# Altium schematic sheet BMS_Switches.SchDoc
size A
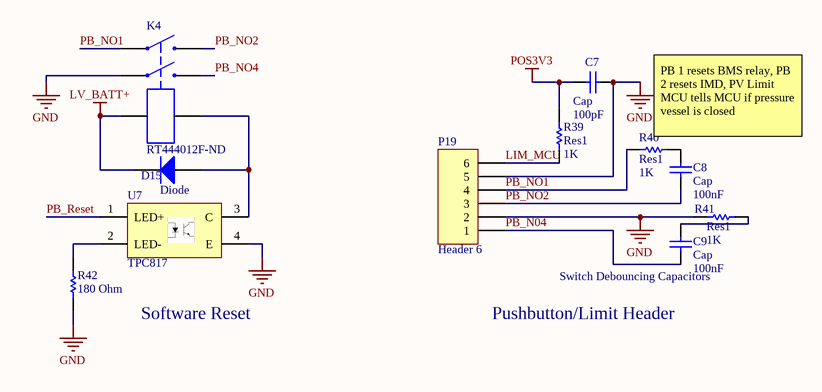
[diagram p0: BMS_Switches.SchDoc]

## Parts
C7  Cap  value 100pF  [1206]
C8  Cap  value 100nF  [1206]
C9  Cap  value 100nF  [1206]
D15  Diode  [1N4007]
K4  RT444012F-ND  [RT444012F]
P19  Header 6  [6POS TERM BLOCK]
R39  Res1  value 1K  [1206]
R40  Res1  value 1K  [1206]
R41  Res1  value 1K  [1206]
R42  value 180 Ohm  [1206]  (hidden comment: Res1)
U7  TPC817  [4-SOP]

## Nets
GND: C7.1 K4.3 P19.2 P19.5 R41.1 R42.2 U7.4(E)
LV_BATT+: D15.2(K) K4.1
POS3V3: C7.2 R39.2
LIM_MCU: P19.6 R39.1
PB_N04: C9.1 P19.1
PB_NO1: K4.5 P19.4 R40.1
PB_NO2: C8.1 K4.6 P19.3
PB_NO4: K4.4
PB_Reset: U7.1(LED+)
NetC8_2: C8.2 R40.2
NetC9_2: C9.2 R41.2
NetD15_1: D15.1(A) K4.2 U7.3(C)
NetR42_1: R42.1 U7.2(LED-)

## Notes on the sheet
- (near R40) PB 1 resets BMS relay, PB 2 resets IMD, PV Limit MCU tells MCU if pressure vessel is closed
- (near C9) Switch Debouncing Capacitors
- Software Reset
- Pushbutton/Limit Header

## Library data of the parts
C7-C9 = Cap: Capacitor; Published: 8-Jun-2000; LatestRevisionDate: 17-Jul-2002; LatestRevisionNote: Re-released for DXP Platform.; PackageReference: RAD-0.3; Publisher: Altium Limited; PackageDescription: Radial Cap, Thru-Hole; 2 Leads; 0.3 in Pin Spacing
D15 = Diode: Default Diode; Published: 8-Jun-2000; LatestRevisionDate: 17-Jul-2002; LatestRevisionNote: Re-released for DXP Platform.; PackageVersion: Sep-1996; PackageReference: SMC; Publisher: Altium Limited; PackageDescription: DO-214-AB/SMC; 2 C-Bend Leads; Body 7.9 x 5.9 mm, inc. leads (LxW); Code_JEDEC: DO-214-AB
K4 = RT444012F-ND: RELAY GEN PURPOSE DPST 8A 12V; ComponentLink1Description: Digikey; ComponentLink1URL: https://www.digikey.com/product-detail/en/te-connectivity-potter-brumfield-relays/RT444012F/RT444012F-ND/1427665
P19 = Header 6: Header, 6-Pin; LatestRevisionDate: 17-Jul-2002; LatestRevisionNote: Re-released for DXP Platform.; Publisher: Altium Limited
R39-R42 = Res1: Resistor; Published: 8-Jun-2000; LatestRevisionDate: 17-Jul-2002; LatestRevisionNote: Re-released for DXP Platform.; PackageReference: AXIAL-0.3; Publisher: Altium Limited; PackageDescription: Axial Device, Thru-Hole; 2 Leads; 0.3 in Pin Spacing
U7 = TPC817: Opto-Coupler; ComponentLink1Description: Digi-Key; ComponentLink1URL: https://www.digikey.com/product-detail/en/taiwan-semiconductor-corporation/TPC817S1D-RAG/TPC817S1D-RAGCT-ND/7359685; ComponentLink2Description: Datasheet; ComponentLink2URL: http://www.taiwansemi.com/products/datasheet/TPC817%20SERIES_C1612.pdf